# Altium schematic sheet 09_FPGA_banks_6_7_8.SchDoc: FPGA banks 6, 7, 8
size A3; Organization: Lime Microsystems; Address1: Surrey Tech Centre; Address2: Guildford GU2 7YG; Address3: Surrey; Address4: United Kingdom; Revision: v1.3; SheetNumber: 9; SheetTotal: 16
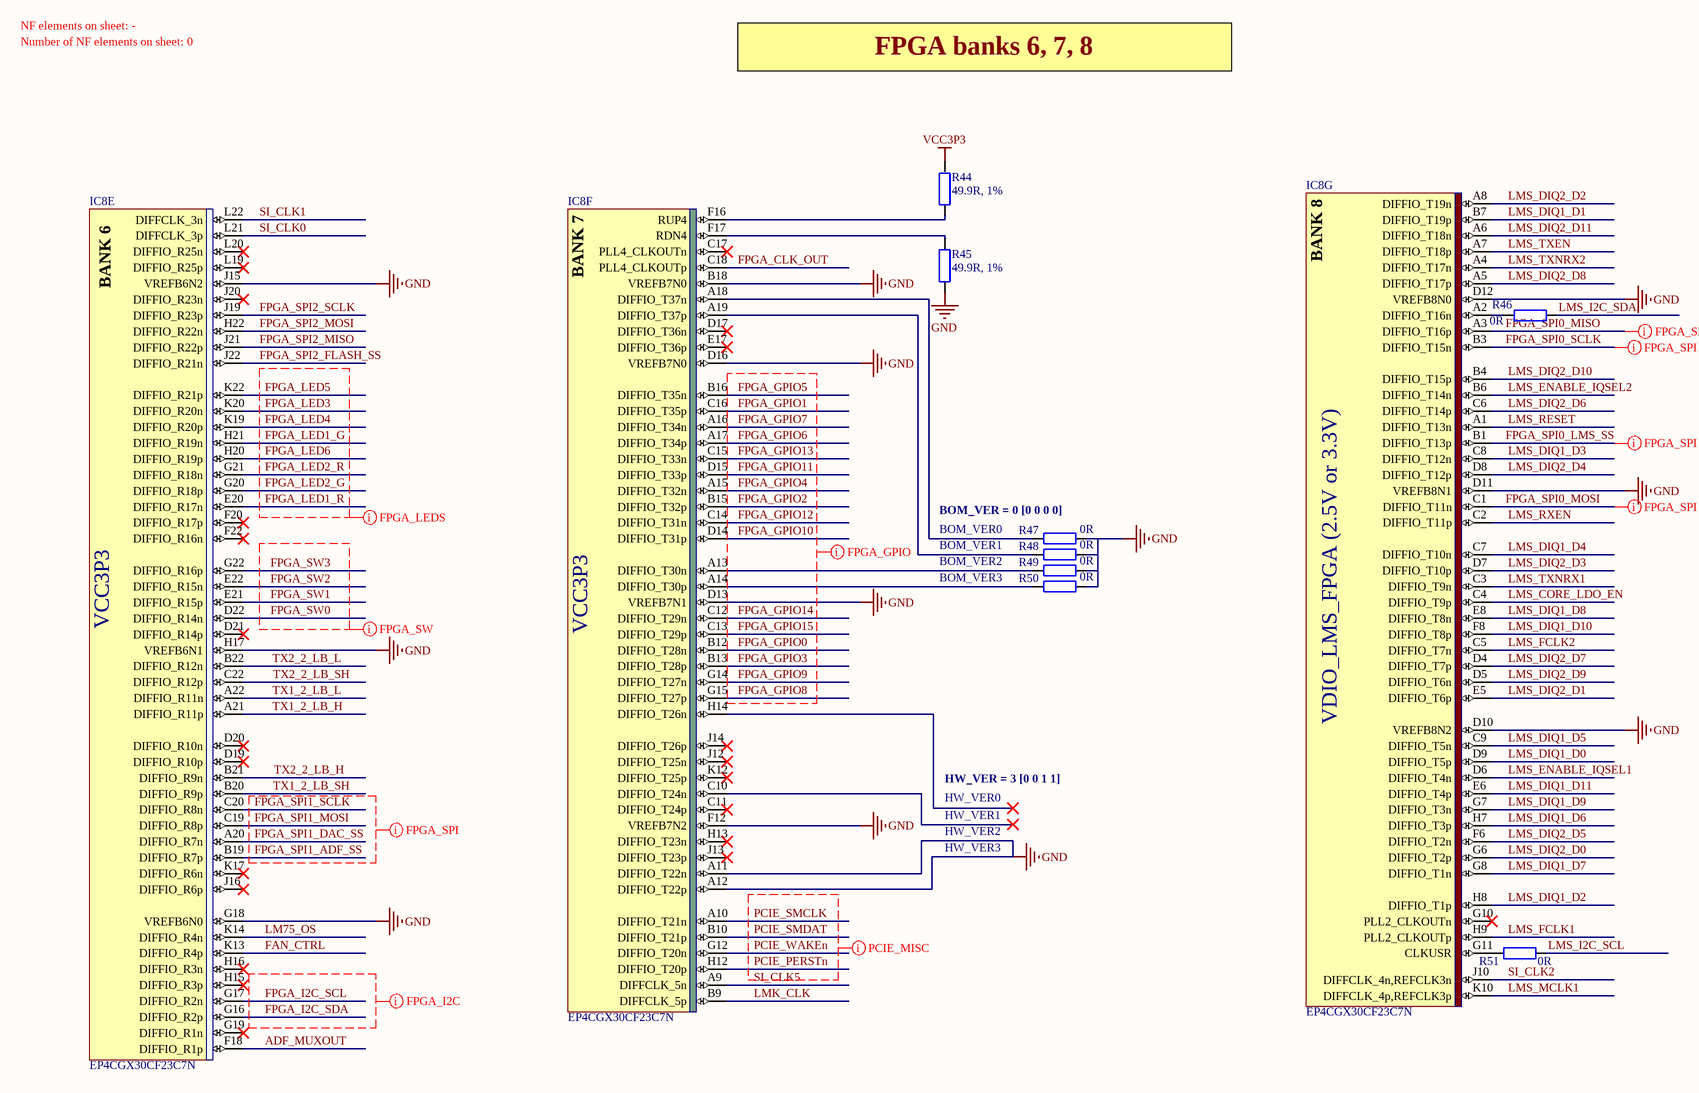
[diagram p0: 09_FPGA_banks_6_7_8.SchDoc]

## Parts
IC8  EP4CGX30CF23C7N  [ALTR-FBGA484_A-200]  (parts E,F,G of 10)
R44  49.9R, 1%  [RES0402]
R45  49.9R, 1%  [RES0402]
R46  0R  [RES0402]
R47  0R  [RES0402]
R48  0R  [RES0402]
R49  0R  [RES0402]
R50  0R  [RES0402]
R51  0R  [RES0402]

## Nets
GND: IC8.A11(DIFFIO_T22n) IC8.A12(DIFFIO_T22p) IC8.B18(VREFB7N0) IC8.D10(VREFB8N2) IC8.D11(VREFB8N1) IC8.D12(VREFB8N0) IC8.D13(VREFB7N1) IC8.D16(VREFB7N0) IC8.F12(VREFB7N2) IC8.G18(VREFB6N0) IC8.H17(VREFB6N1) IC8.J15(VREFB6N2) R45.1 R47.1 R48.1 R49.1 R50.1
VCC3P3: R44.2
ADF_MUXOUT: IC8.F18(DIFFIO_R1p)
FAN_CTRL: IC8.K13(DIFFIO_R4p)
FPGA_CLK_OUT: IC8.C18(PLL4_CLKOUTp)
FPGA_GPIO0: IC8.B12(DIFFIO_T28n)
FPGA_GPIO1: IC8.C16(DIFFIO_T35p)
FPGA_GPIO2: IC8.B15(DIFFIO_T32p)
FPGA_GPIO3: IC8.B13(DIFFIO_T28p)
FPGA_GPIO4: IC8.A15(DIFFIO_T32n)
FPGA_GPIO5: IC8.B16(DIFFIO_T35n)
FPGA_GPIO6: IC8.A17(DIFFIO_T34p)
FPGA_GPIO7: IC8.A16(DIFFIO_T34n)
FPGA_GPIO8: IC8.G15(DIFFIO_T27p)
FPGA_GPIO9: IC8.G14(DIFFIO_T27n)
FPGA_GPIO10: IC8.D14(DIFFIO_T31p)
FPGA_GPIO11: IC8.D15(DIFFIO_T33p)
FPGA_GPIO12: IC8.C14(DIFFIO_T31n)
FPGA_GPIO13: IC8.C15(DIFFIO_T33n)
FPGA_GPIO14: IC8.C12(DIFFIO_T29n)
FPGA_GPIO15: IC8.C13(DIFFIO_T29p)
FPGA_I2C_SCL: IC8.G17(DIFFIO_R2n)
FPGA_I2C_SDA: IC8.G16(DIFFIO_R2p)
FPGA_LED1_G: IC8.H21(DIFFIO_R19n)
FPGA_LED1_R: IC8.E20(DIFFIO_R17n)
FPGA_LED2_G: IC8.G20(DIFFIO_R18p)
FPGA_LED2_R: IC8.G21(DIFFIO_R18n)
FPGA_LED3: IC8.K20(DIFFIO_R20n)
FPGA_LED4: IC8.K19(DIFFIO_R20p)
FPGA_LED5: IC8.K22(DIFFIO_R21p)
FPGA_LED6: IC8.H20(DIFFIO_R19p)
FPGA_SPI0_LMS_SS: IC8.B1(DIFFIO_T13p)
FPGA_SPI0_MISO: IC8.A3(DIFFIO_T16p)
FPGA_SPI0_MOSI: IC8.C1(DIFFIO_T11n)
FPGA_SPI0_SCLK: IC8.B3(DIFFIO_T15n)
FPGA_SPI1_ADF_SS: IC8.B19(DIFFIO_R7p)
FPGA_SPI1_DAC_SS: IC8.A20(DIFFIO_R7n)
FPGA_SPI1_MOSI: IC8.C19(DIFFIO_R8p)
FPGA_SPI1_SCLK: IC8.C20(DIFFIO_R8n)
FPGA_SPI2_FLASH_SS: IC8.J22(DIFFIO_R21n)
FPGA_SPI2_MISO: IC8.J21(DIFFIO_R22p)
FPGA_SPI2_MOSI: IC8.H22(DIFFIO_R22n)
FPGA_SPI2_SCLK: IC8.J19(DIFFIO_R23p)
FPGA_SW0: IC8.D22(DIFFIO_R14n)
FPGA_SW1: IC8.E21(DIFFIO_R15p)
FPGA_SW2: IC8.E22(DIFFIO_R15n)
FPGA_SW3: IC8.G22(DIFFIO_R16p)
LM75_OS: IC8.K14(DIFFIO_R4n)
LMK_CLK: IC8.B9(DIFFCLK_5p)
LMS_CORE_LDO_EN: IC8.C4(DIFFIO_T9p)
LMS_DIQ1_D0: IC8.D9(DIFFIO_T5p)
LMS_DIQ1_D1: IC8.B7(DIFFIO_T19p)
LMS_DIQ1_D2: IC8.H8(DIFFIO_T1p)
LMS_DIQ1_D3: IC8.C8(DIFFIO_T12n)
LMS_DIQ1_D4: IC8.C7(DIFFIO_T10n)
LMS_DIQ1_D5: IC8.C9(DIFFIO_T5n)
LMS_DIQ1_D6: IC8.H7(DIFFIO_T3p)
LMS_DIQ1_D7: IC8.G8(DIFFIO_T1n)
LMS_DIQ1_D8: IC8.E8(DIFFIO_T8n)
LMS_DIQ1_D9: IC8.G7(DIFFIO_T3n)
LMS_DIQ1_D10: IC8.F8(DIFFIO_T8p)
LMS_DIQ1_D11: IC8.E6(DIFFIO_T4p)
LMS_DIQ2_D0: IC8.G6(DIFFIO_T2p)
LMS_DIQ2_D1: IC8.E5(DIFFIO_T6p)
LMS_DIQ2_D2: IC8.A8(DIFFIO_T19n)
LMS_DIQ2_D3: IC8.D7(DIFFIO_T10p)
LMS_DIQ2_D4: IC8.D8(DIFFIO_T12p)
LMS_DIQ2_D5: IC8.F6(DIFFIO_T2n)
LMS_DIQ2_D6: IC8.C6(DIFFIO_T14p)
LMS_DIQ2_D7: IC8.D4(DIFFIO_T7p)
LMS_DIQ2_D8: IC8.A5(DIFFIO_T17p)
LMS_DIQ2_D9: IC8.D5(DIFFIO_T6n)
LMS_DIQ2_D10: IC8.B4(DIFFIO_T15p)
LMS_DIQ2_D11: IC8.A6(DIFFIO_T18n)
LMS_ENABLE_IQSEL1: IC8.D6(DIFFIO_T4n)
LMS_ENABLE_IQSEL2: IC8.B6(DIFFIO_T14n)
LMS_FCLK1: IC8.H9(PLL2_CLKOUTp)
LMS_FCLK2: IC8.C5(DIFFIO_T7n)
LMS_I2C_SCL: R51.1
LMS_I2C_SDA: R46.1
LMS_MCLK1: IC8.K10(DIFFCLK_4p,REFCLK3p)
LMS_RESET: IC8.A1(DIFFIO_T13n)
LMS_RXEN: IC8.C2(DIFFIO_T11p)
LMS_TXEN: IC8.A7(DIFFIO_T18p)
LMS_TXNRX1: IC8.C3(DIFFIO_T9n)
LMS_TXNRX2: IC8.A4(DIFFIO_T17n)
PCIE_PERSTn: IC8.H12(DIFFIO_T20p)
PCIE_SMCLK: IC8.A10(DIFFIO_T21n)
PCIE_SMDAT: IC8.B10(DIFFIO_T21p)
PCIE_WAKEn: IC8.G12(DIFFIO_T20n)
SI_CLK0: IC8.L21(DIFFCLK_3p)
SI_CLK1: IC8.L22(DIFFCLK_3n)
SI_CLK2: IC8.J10(DIFFCLK_4n,REFCLK3n)
SI_CLK5: IC8.A9(DIFFCLK_5n)
TX1_2_LB_H: IC8.A21(DIFFIO_R11p)
TX1_2_LB_L: IC8.A22(DIFFIO_R11n)
TX1_2_LB_SH: IC8.B20(DIFFIO_R9p)
TX2_2_LB_H: IC8.B21(DIFFIO_R9n)
TX2_2_LB_L: IC8.B22(DIFFIO_R12n)
TX2_2_LB_SH: IC8.C22(DIFFIO_R12p)
NetIC8_A2: IC8.A2(DIFFIO_T16n) R46.2
NetIC8_A13: IC8.A13(DIFFIO_T30n) R49.2
NetIC8_A14: IC8.A14(DIFFIO_T30p) R50.2
NetIC8_A18: IC8.A18(DIFFIO_T37n) R47.2
NetIC8_A19: IC8.A19(DIFFIO_T37p) R48.2
NetIC8_F16: IC8.F16(RUP4) R44.1
NetIC8_F17: IC8.F17(RDN4) R45.2
NetIC8_G11: IC8.G11(CLKUSR) R51.2

Not connected (* = marked no-connect by the designer): IC8 C10(DIFFIO_T24n)* C11(DIFFIO_T24p)* C17(PLL4_CLKOUTn)* D17(DIFFIO_T36n)* D19(DIFFIO_R10p)* D20(DIFFIO_R10n)* D21(DIFFIO_R14p)* E17(DIFFIO_T36p)* F20(DIFFIO_R17p)* F22(DIFFIO_R16n)* G10(PLL2_CLKOUTn)* G19(DIFFIO_R1n)* H13(DIFFIO_T23n)* H14(DIFFIO_T26n)* H15(DIFFIO_R3p)* H16(DIFFIO_R3n)* J12(DIFFIO_T25n)* J13(DIFFIO_T23p)* J14(DIFFIO_T26p)* J16(DIFFIO_R6p)* J20(DIFFIO_R23n)* K12(DIFFIO_T25p)* K17(DIFFIO_R6n)* L19(DIFFIO_R25p)* L20(DIFFIO_R25n)*

## Layout directives
net class FPGA_GPIO: FPGA_GPIO0, FPGA_GPIO1, FPGA_GPIO2, FPGA_GPIO3, FPGA_GPIO4, FPGA_GPIO5, FPGA_GPIO6, FPGA_GPIO7, FPGA_GPIO8, FPGA_GPIO9, FPGA_GPIO10, FPGA_GPIO11, FPGA_GPIO12, FPGA_GPIO13, FPGA_GPIO14, FPGA_GPIO15
net class FPGA_LEDS: FPGA_LED1_G, FPGA_LED1_R, FPGA_LED2_G, FPGA_LED2_R, FPGA_LED3, FPGA_LED4, FPGA_LED5, FPGA_LED6
net class FPGA_SW: FPGA_SW0, FPGA_SW1, FPGA_SW2, FPGA_SW3
net class PCIE_MISC: PCIE_PERSTn, PCIE_SMCLK, PCIE_SMDAT, PCIE_WAKEn
net class FPGA_SPI: FPGA_SPI0_LMS_SS, FPGA_SPI0_MISO, FPGA_SPI0_MOSI, FPGA_SPI0_SCLK, FPGA_SPI1_ADF_SS, FPGA_SPI1_DAC_SS, FPGA_SPI1_MOSI, FPGA_SPI1_SCLK
net class FPGA_I2C: FPGA_I2C_SCL, FPGA_I2C_SDA

## Notes on the sheet
- NF elements on sheet: -
- Number of NF elements on sheet: 0
- FPGA banks 6, 7, 8
- (near R47) BOM_VER = 0 [0 0 0 0]
- BOM_VER0
- BOM_VER1
- BOM_VER2
- VCC3P3
- BOM_VER3
- VDIO_LMS_FPGA (2.5V or 3.3V)
- HW_VER0
- HW_VER1
- HW_VER2
- HW_VER = 3 [0 0 1 1]
- HW_VER3
- Project name:
- Title:
- Size:
- Date:
- A3
- Revision:
- Time:
- Sheet
- of
- File:
- (in symbol EP4CGX30CF23C7N, part E) BANK 6
- (in symbol EP4CGX30CF23C7N, part F) BANK 7
- (in symbol EP4CGX30CF23C7N, part G) BANK 8

## Library data of the parts
IC8 = EP4CGX30CF23C7N: Manufacturer: Altera; Part Description: IC FPGA 290 I/O 484FBGA; Voltage - Supply: 1.16 V ~ 1.24 V; Number of I/O: 290; Total RAM Bits: 1105920; Number of Logic Elements/Cells: 29440; Number of LABs/CLBs: 1840; Supplier 1: Digi-Key; Package / Case: 484-BGA; Operating Temperature: 0°C ~ 85°C; Mounting Type: Surface Mount; Number of Gates: -; Supplier Device Package: 484-FBGA (23x23); Category: Integrated Circuits (ICs); RoHS: RoHS Compliant; Supplier Part Number 1: 544-2730-ND; Manufacturer Part Number 1: EP4CGX30CF23C7N
R44 R45 = Res_0402: Manufacturer: Samsung Electro-Mechanics America, Inc.; Manufacturer Part Number: RC1005F49R9CS; Part Description: RES SMD 49.9 OHM 1% 1/16W 0402; Temperature Coefficient: ±100ppm/°C; Resistance (Ohms): 49.9; Power (Watts): 0.063W, 1/16W; Number of Terminations: 2; Size / Dimension: 0.039" L x 0.020" W (1.00mm x 0.50mm); Supplier Device Package: 0402 (1005 Metric); RoHS: RoHS Compliant; Supplier Part Number 1: 1276-3469-6-ND; Features: -; Packaging: Digi-Reel®; Tolerance: ±1%; Height: 0.016" (0.40mm); Category: Resistors; Composition: Thick Film; Package / Case: 0402 (1005 Metric); Supplier 1: Digi-Key; Operating Temperature: -55°C ~ 155°C; Value: 49.9R, 1%
R46-R51 = Res_0402: Manufacturer: Yageo; Part Description: RES SMD 0.0OHM JUMPER 1/16W 0402; Supplier 1: Digi-Key; Supplier Part Number 1: 311-0.0JRTR-ND; Composition: Thick Film; Package / Case: 0402 (1005 Metric); Category: Resistors; Value: 0R